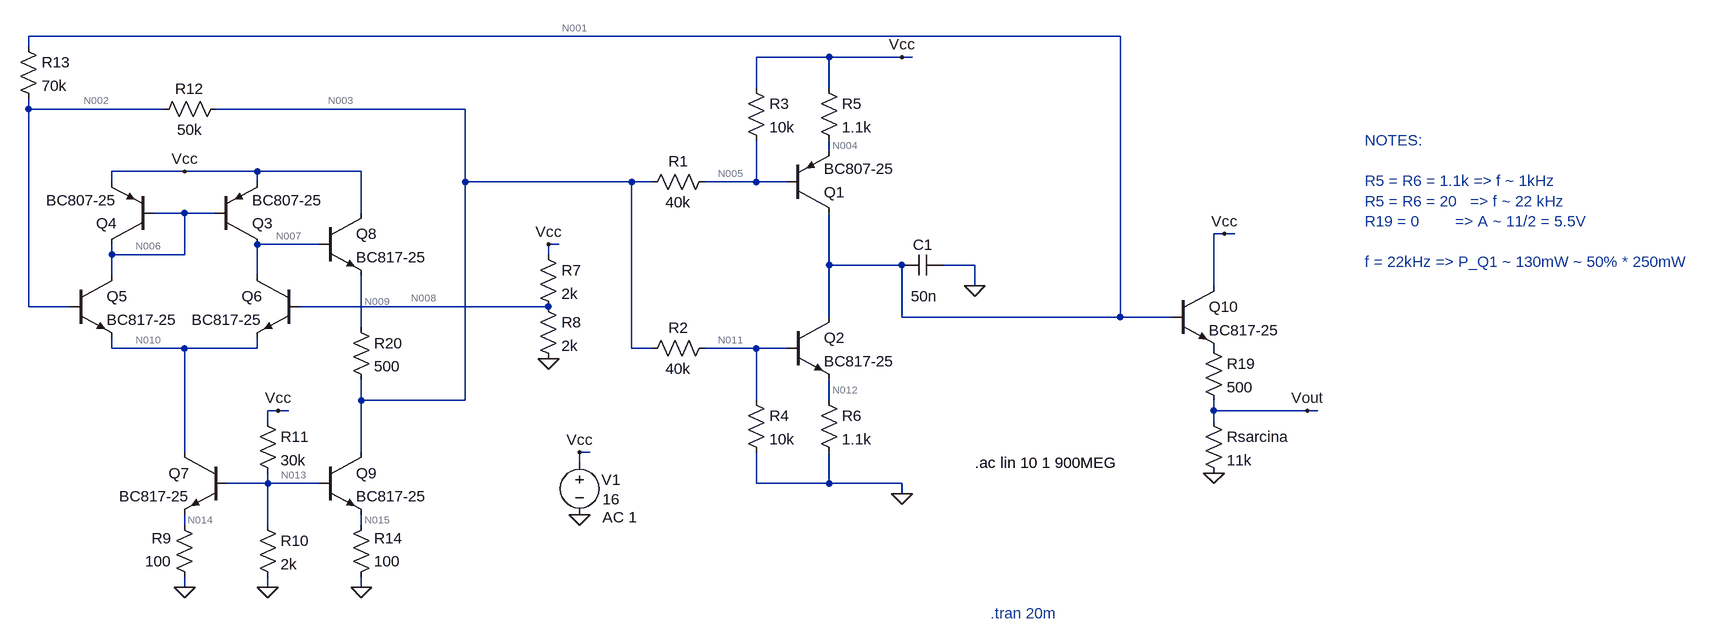
[diagram p0: schematic DualConstCurrent.asc]
DualConstCurrent.asc, the LTspice schematic file:
Version 4
SHEET 1 2872 832
WIRE 704 -144 -976 -144
WIRE -976 -128 -976 -144
WIRE 256 -112 144 -112
WIRE 368 -112 256 -112
WIRE 384 -112 368 -112
WIRE 144 -64 144 -112
WIRE 256 -64 256 -112
WIRE -976 -32 -976 -48
WIRE -768 -32 -976 -32
WIRE -304 -32 -688 -32
WIRE 256 32 256 16
WIRE -736 64 -848 64
WIRE -624 64 -736 64
WIRE -464 64 -624 64
WIRE -848 80 -848 64
WIRE -624 80 -624 64
WIRE -304 80 -304 -32
WIRE -48 80 -304 80
WIRE -16 80 -48 80
WIRE 144 80 144 16
WIRE 144 80 64 80
WIRE 192 80 144 80
WIRE -736 128 -784 128
WIRE -688 128 -736 128
WIRE -464 128 -464 64
WIRE 864 160 848 160
WIRE 880 160 864 160
WIRE -528 176 -624 176
WIRE -160 176 -176 176
WIRE -848 192 -848 176
WIRE -736 192 -736 128
WIRE -736 192 -848 192
WIRE -176 192 -176 176
WIRE 256 208 256 128
WIRE 368 208 256 208
WIRE 480 208 432 208
WIRE -848 224 -848 192
WIRE -624 224 -624 176
WIRE 480 240 480 208
WIRE 848 240 848 160
WIRE -976 272 -976 -32
WIRE -912 272 -976 272
WIRE -176 272 -560 272
WIRE 256 288 256 208
WIRE 368 288 368 208
WIRE 704 288 704 -144
WIRE 704 288 368 288
WIRE 784 288 704 288
WIRE -464 304 -464 224
WIRE -848 336 -848 320
WIRE -736 336 -848 336
WIRE -624 336 -624 320
WIRE -624 336 -736 336
WIRE -48 336 -48 80
WIRE -16 336 -48 336
WIRE 144 336 64 336
WIRE 192 336 144 336
WIRE -464 416 -464 384
WIRE -304 416 -304 80
WIRE -304 416 -464 416
WIRE 144 416 144 336
WIRE 256 416 256 384
WIRE -592 432 -608 432
WIRE -576 432 -592 432
WIRE 848 432 848 416
WIRE 992 432 848 432
WIRE 1008 432 992 432
WIRE -608 448 -608 432
WIRE 848 448 848 432
WIRE -736 496 -736 336
WIRE -464 496 -464 416
WIRE -112 496 -128 496
WIRE -128 512 -128 496
WIRE -608 544 -608 528
WIRE -608 544 -672 544
WIRE -528 544 -608 544
WIRE 144 544 144 496
WIRE 256 544 256 496
WIRE 256 544 144 544
WIRE 368 544 256 544
WIRE 368 560 368 544
WIRE -736 608 -736 592
WIRE -608 608 -608 544
WIRE -464 608 -464 592
WIRE -736 704 -736 688
WIRE -608 704 -608 688
WIRE -464 704 -464 688
FLAG -736 704 0
FLAG -608 704 0
FLAG -592 432 Vcc
FLAG -128 592 0
FLAG -128 496 Vcc
FLAG -736 64 Vcc
FLAG 368 -112 Vcc
FLAG 368 560 0
FLAG 480 240 0
FLAG -176 352 0
FLAG -176 176 Vcc
FLAG -464 704 0
FLAG 864 160 Vcc
FLAG 848 528 0
FLAG 992 432 Vout
SYMBOL pnp 192 128 M180
SYMATTR InstName Q1
SYMATTR Value BC807-25
SYMBOL npn 192 288 R0
SYMATTR InstName Q2
SYMATTR Value BC817-25
SYMBOL cap 432 192 R90
WINDOW 0 0 32 VBottom 2
WINDOW 3 48 30 VTop 2
SYMATTR InstName C1
SYMATTR Value 50n
SYMBOL res 240 -80 R0
SYMATTR InstName R5
SYMATTR Value 1.1k
SYMBOL res 240 400 R0
SYMATTR InstName R6
SYMATTR Value 1.1k
SYMBOL res 80 64 R90
WINDOW 0 0 56 VBottom 2
WINDOW 3 32 56 VTop 2
SYMATTR InstName R1
SYMATTR Value 40k
SYMBOL res 80 320 R90
WINDOW 0 0 56 VBottom 2
WINDOW 3 32 56 VTop 2
SYMATTR InstName R2
SYMATTR Value 40k
SYMBOL pnp -688 176 M180
SYMATTR InstName Q3
SYMATTR Value BC807-25
SYMBOL pnp -784 176 R180
SYMATTR InstName Q4
SYMATTR Value BC807-25
SYMBOL npn -912 224 R0
SYMATTR InstName Q5
SYMATTR Value BC817-25
SYMBOL npn -560 224 M0
SYMATTR InstName Q6
SYMATTR Value BC817-25
SYMBOL npn -672 496 M0
SYMATTR InstName Q7
SYMATTR Value BC817-25
SYMBOL res -720 704 R180
WINDOW 0 36 76 Left 2
WINDOW 3 36 40 Left 2
SYMATTR InstName R9
SYMATTR Value 100
SYMBOL res -624 592 R0
SYMATTR InstName R10
SYMATTR Value 2k
SYMBOL res -624 432 R0
SYMATTR InstName R11
SYMATTR Value 30k
SYMBOL voltage -128 496 R0
WINDOW 0 34 42 Left 2
WINDOW 3 35 72 Left 2
WINDOW 123 35 100 Left 2
WINDOW 39 0 0 Left 0
SYMATTR InstName V1
SYMATTR Value 16
SYMATTR Value2 AC 1
SYMBOL res 128 -80 R0
SYMATTR InstName R3
SYMATTR Value 10k
SYMBOL res 128 400 R0
SYMATTR InstName R4
SYMATTR Value 10k
SYMBOL res -192 176 R0
SYMATTR InstName R7
SYMATTR Value 2k
SYMBOL res -192 256 R0
SYMATTR InstName R8
SYMATTR Value 2k
SYMBOL res -672 -48 R90
WINDOW 0 0 56 VBottom 2
WINDOW 3 32 56 VTop 2
SYMATTR InstName R12
SYMATTR Value 50k
SYMBOL res -992 -144 R0
SYMATTR InstName R13
SYMATTR Value 70k
SYMBOL npn -528 128 R0
SYMATTR InstName Q8
SYMATTR Value BC817-25
SYMBOL npn -528 496 R0
SYMATTR InstName Q9
SYMATTR Value BC817-25
SYMBOL res -480 704 M180
WINDOW 0 36 76 Left 2
WINDOW 3 36 40 Left 2
SYMATTR InstName R14
SYMATTR Value 100
SYMBOL npn 784 240 R0
SYMATTR InstName Q10
SYMATTR Value BC817-25
SYMBOL res 832 320 R0
SYMATTR InstName R19
SYMATTR Value 500
SYMBOL res 832 432 R0
SYMATTR InstName Rsarcina
SYMATTR Value 11k
SYMBOL res -480 288 R0
SYMATTR InstName R20
SYMATTR Value 500
TEXT 504 744 Left 2 ;.tran 20m
TEXT 1080 16 Left 2 ;NOTES:\n \nR5 = R6 = 1.1k => f ~ 1kHz\nR5 = R6 = 20   => f ~ 22 kHz\nR19 = 0        => A ~ 11/2 = 5.5V\n \nf = 22kHz => P_Q1 ~ 130mW ~ 50% * 250mW
TEXT 480 512 Left 2 !.ac lin 10 1 900MEG

The netlist it stands for:
* DualConstCurrent.asc
Q1 N001 N005 N004 0 BC807-25
Q2 N001 N011 N012 0 BC817-25
C1 0 N001 50n
R5 Vcc N004 1.1k
R6 N012 0 1.1k
R1 N005 N003 40k
R2 N011 N003 40k
Q3 N007 N006 Vcc 0 BC807-25
Q4 N006 N006 Vcc 0 BC807-25
Q5 N006 N002 N010 0 BC817-25
Q6 N007 N008 N010 0 BC817-25
Q7 N010 N013 N014 0 BC817-25
R9 0 N014 100
R10 N013 0 2k
R11 Vcc N013 30k
V1 Vcc 0 16 AC 1
R3 Vcc N005 10k
R4 N011 0 10k
R7 Vcc N008 2k
R8 N008 0 2k
R12 N003 N002 50k
R13 N001 N002 70k
Q8 Vcc N007 N009 0 BC817-25
Q9 N003 N013 N015 0 BC817-25
R14 0 N015 100
Q10 Vcc N001 P001 0 BC817-25
R19 P001 Vout 500
Rsarcina Vout 0 11k
R20 N009 N003 500
.model NPN NPN
.model PNP PNP
.lib standard.bjt
* .tran 20m
* NOTES:
* R5 = R6 = 1.1k => f ~ 1kHz
* R5 = R6 = 20   => f ~ 22 kHz
* R19 = 0        => A ~ 11/2 = 5.5V
* f = 22kHz => P_Q1 ~ 130mW ~ 50% * 250mW
.ac lin 10 1 900MEG
.backanno
.end

* Results of the author's LTspice run, read from the files saved beside the schematic
* Operating Point, zero values left out:
*   V(n001) = 8.243 V
*   V(n005) = 14.42 V
*   V(n004) = 15.01 V
*   V(n011) = 1.585 V
*   V(n012) = 988.9 mV
*   V(vcc) = 16 V
*   V(n003) = 8.026 V
*   V(n007) = 10.32 V
*   V(n006) = 15.4 V
*   V(n002) = 7.99 V
*   V(n010) = 7.38 V
*   V(n008) = 7.995 V
*   V(n013) = 964.3 mV
*   V(n014) = 333.6 mV
*   V(n009) = 9.691 V
*   V(n015) = 333.7 mV
*   V(p001) = 7.656 V
*   V(vout) = 7.323 V
*   Ic(Q1) = -901.9 µA
*   Ib(Q1) = -2.298 µA
*   Ie(Q1) = 904.2 µA
*   Ic(Q3) = -1.788 mA
*   Ib(Q3) = -4.618 µA
*   Ie(Q3) = 1.793 mA
*   Ic(Q4) = -1.529 mA
*   Ib(Q4) = -4.624 µA
*   Ie(Q4) = 1.533 mA
*   Ic(Q2) = 896.4 µA
*   Ib(Q2) = 2.554 µA
*   Ie(Q2) = -899 µA
*   Ic(Q5) = 1.538 mA
*   Ib(Q5) = 4.361 µA
*   Ie(Q5) = -1.542 mA
*   Ic(Q6) = 1.778 mA
*   Ib(Q6) = 5.285 µA
*   Ie(Q6) = -1.784 mA
*   Ic(Q7) = 3.326 mA
*   Ib(Q7) = 9.555 µA
*   Ie(Q7) = -3.336 mA
*   Ic(Q8) = 3.32 mA
*   Ib(Q8) = 9.601 µA
*   Ie(Q8) = -3.329 mA
*   Ic(Q9) = 3.327 mA
*   Ib(Q9) = 9.504 µA
*   Ie(Q9) = -3.337 mA
*   Ic(Q10) = 663.8 µA
*   Ib(Q10) = 1.872 µA
*   Ie(Q10) = -665.7 µA
*   I(R5) = 904.2 µA
*   I(R6) = 899 µA
*   I(R1) = 159.9 µA
*   I(R2) = -161 µA
*   I(R9) = -3.336 mA
*   I(R10) = 482.1 µA
*   I(R11) = 501.2 µA
*   I(R3) = 157.6 µA
*   I(R4) = 158.5 µA
*   I(R7) = 4.003 mA
*   I(R8) = 3.997 mA
*   I(R12) = 735.6 nA
*   I(R13) = 3.625 µA
*   I(R14) = -3.337 mA
*   I(R19) = 665.7 µA
*   I(Rsarcina) = 665.7 µA
*   I(R20) = 3.329 mA
*   I(V1) = -12.88 mA